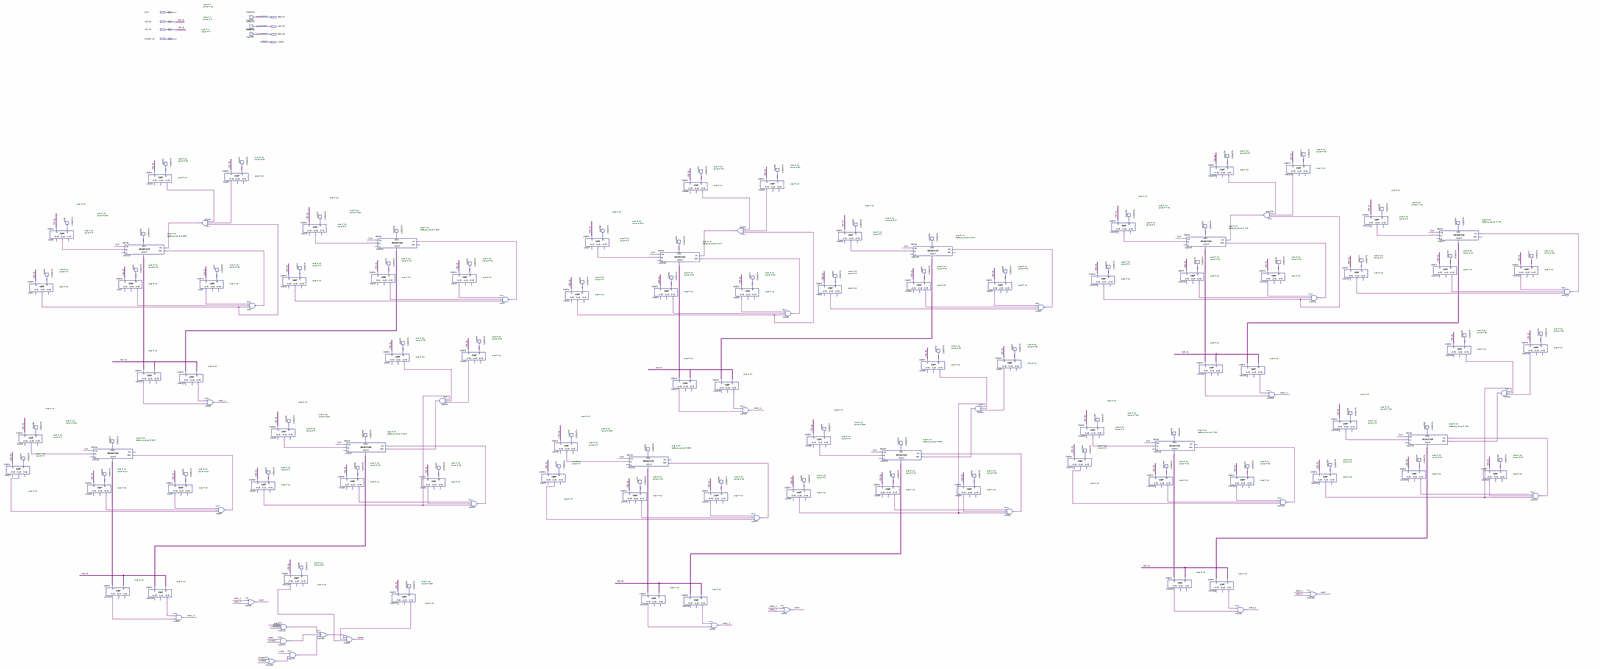
[diagram p0: schematic sheet, whole]
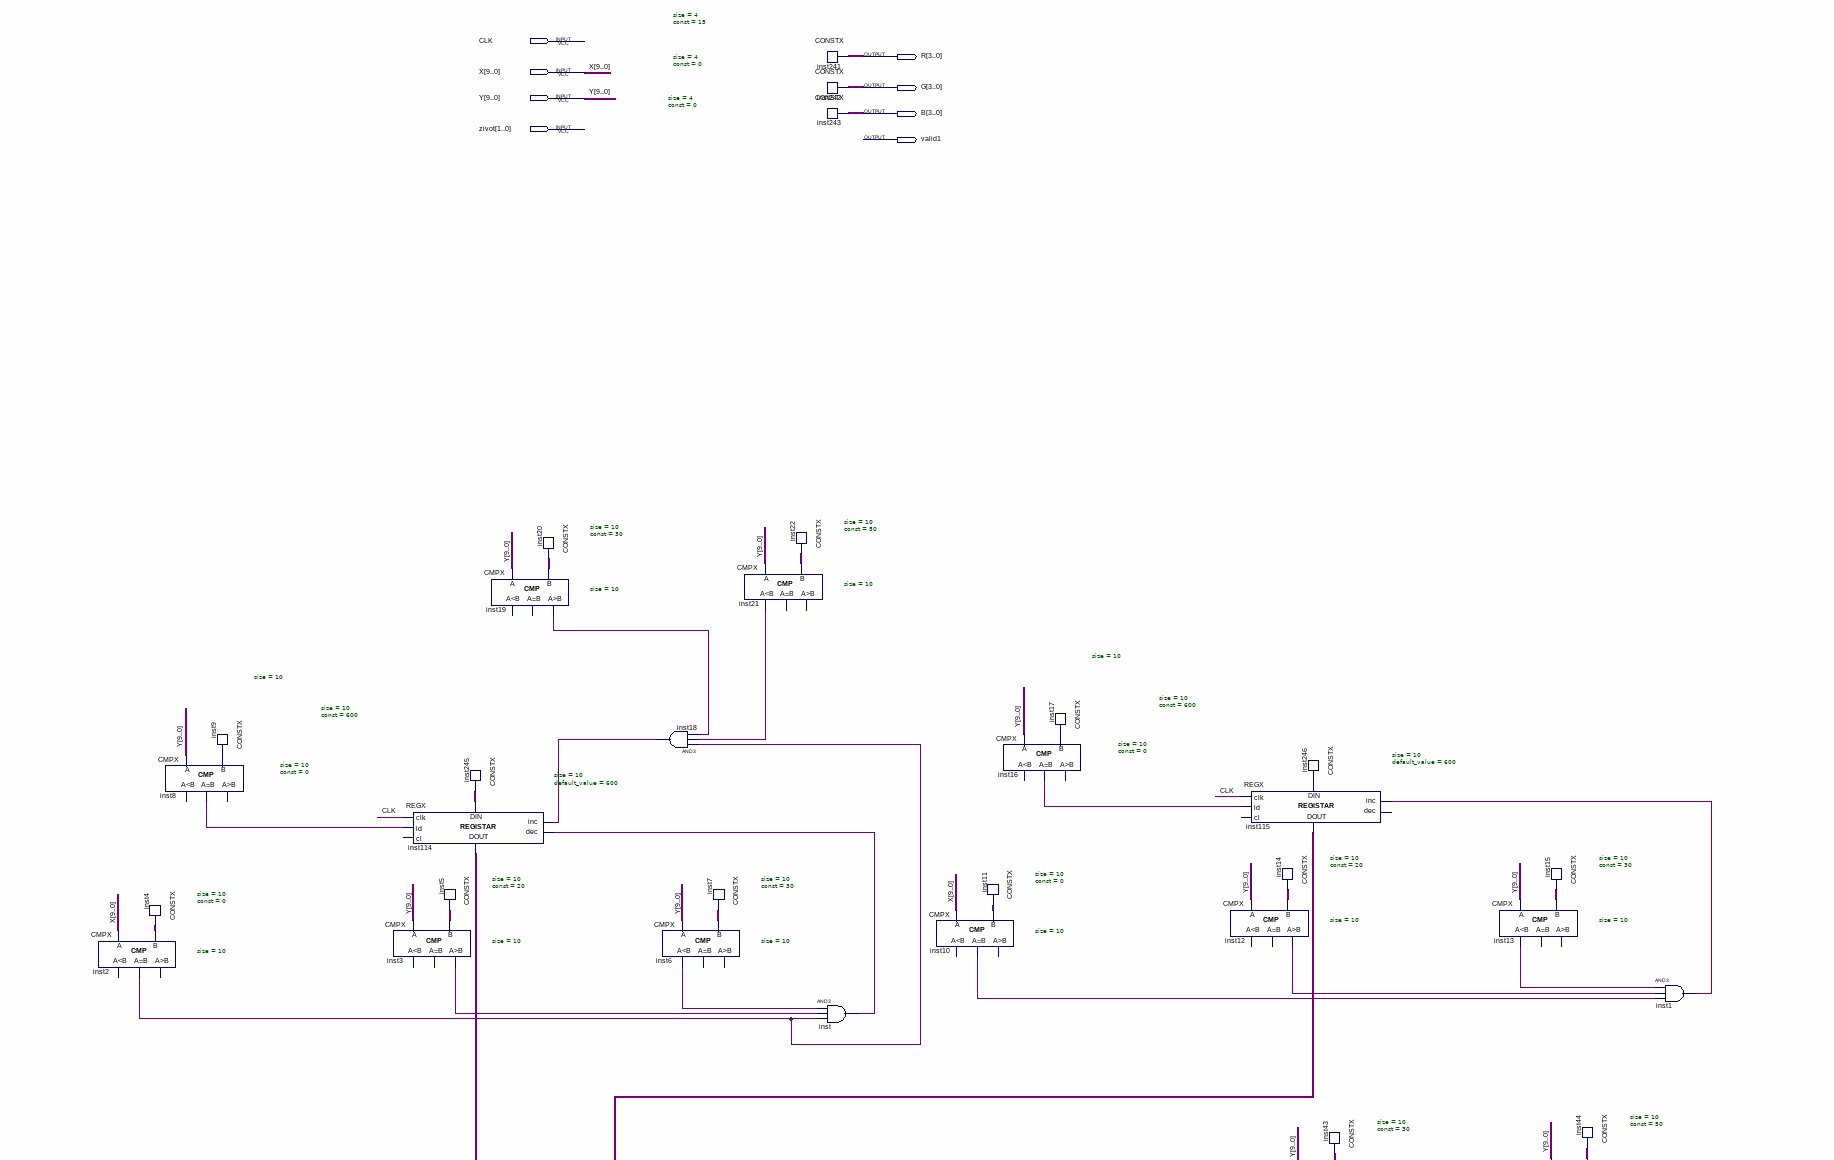
[diagram p1: schematic sheet, upper left part]
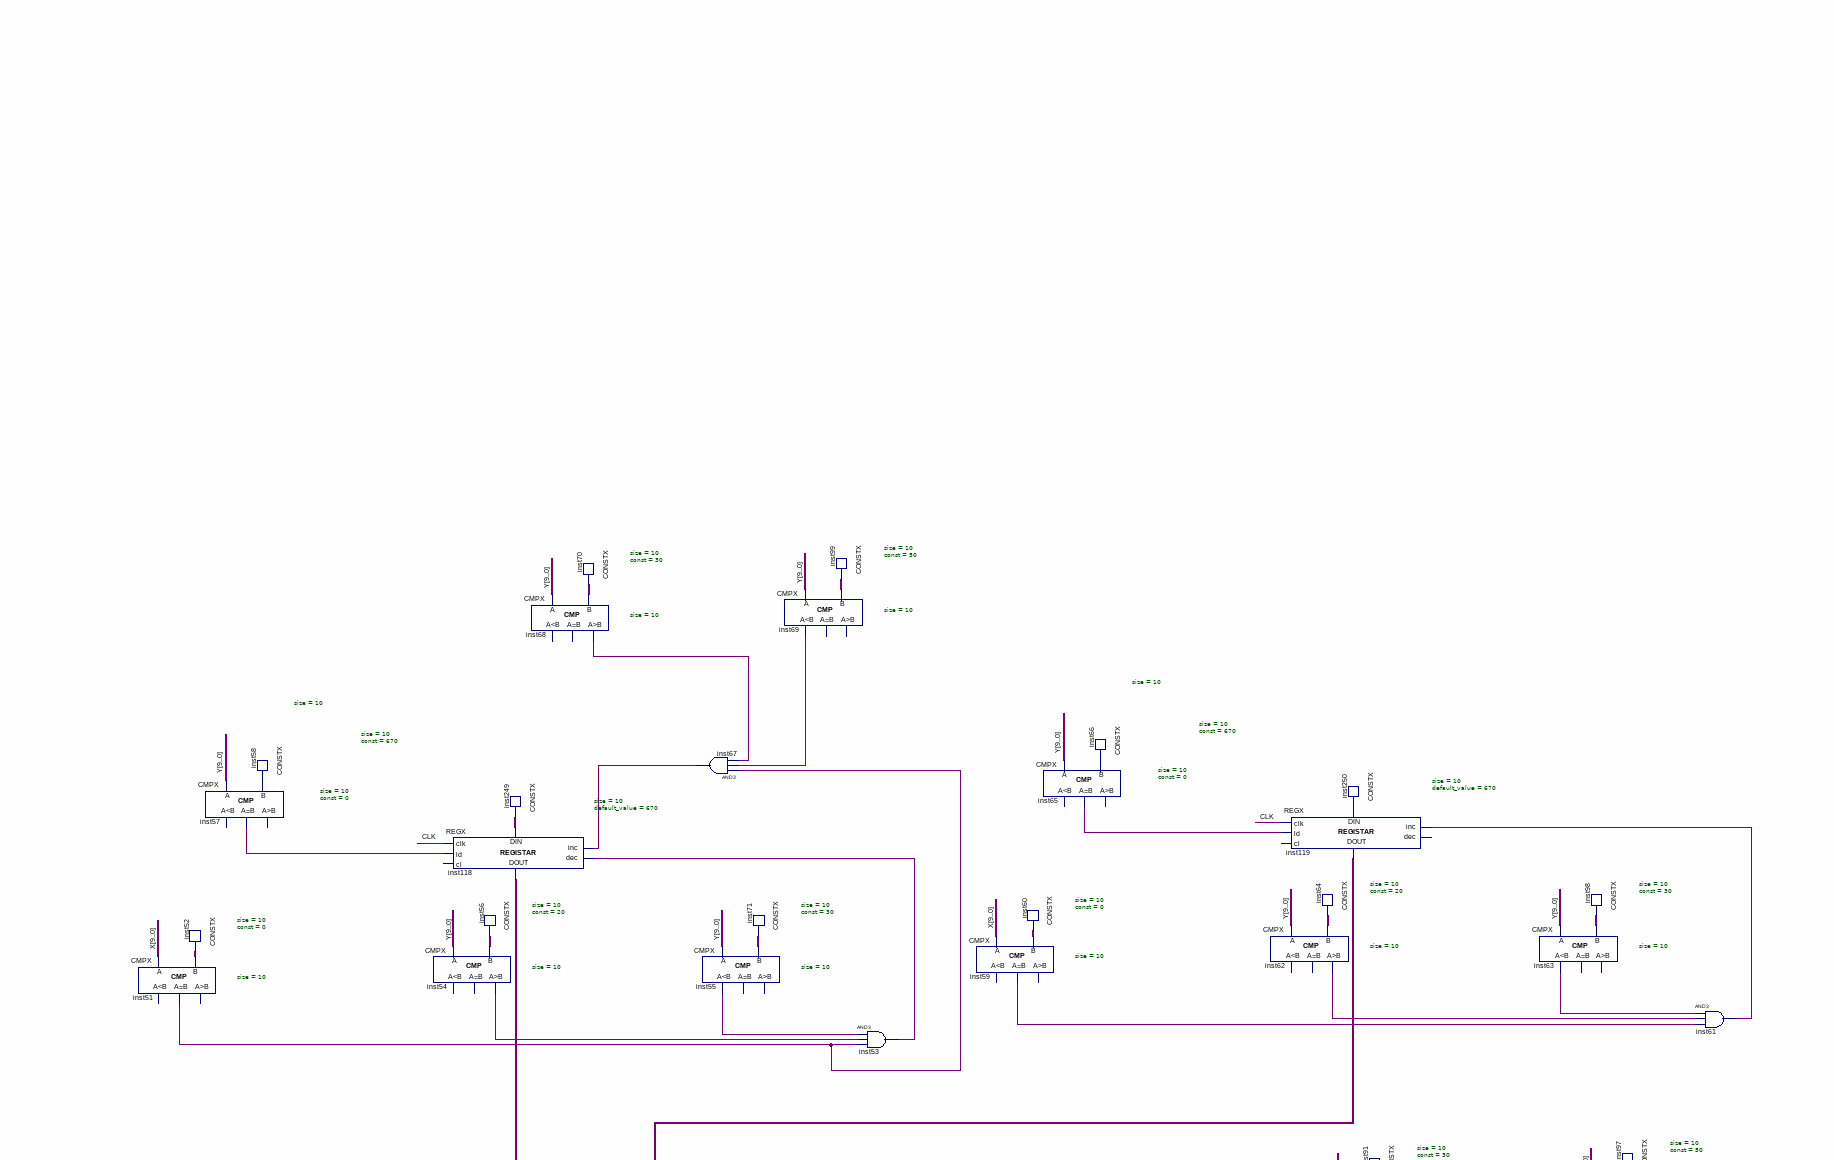
[diagram p2: schematic sheet, upper centre part]
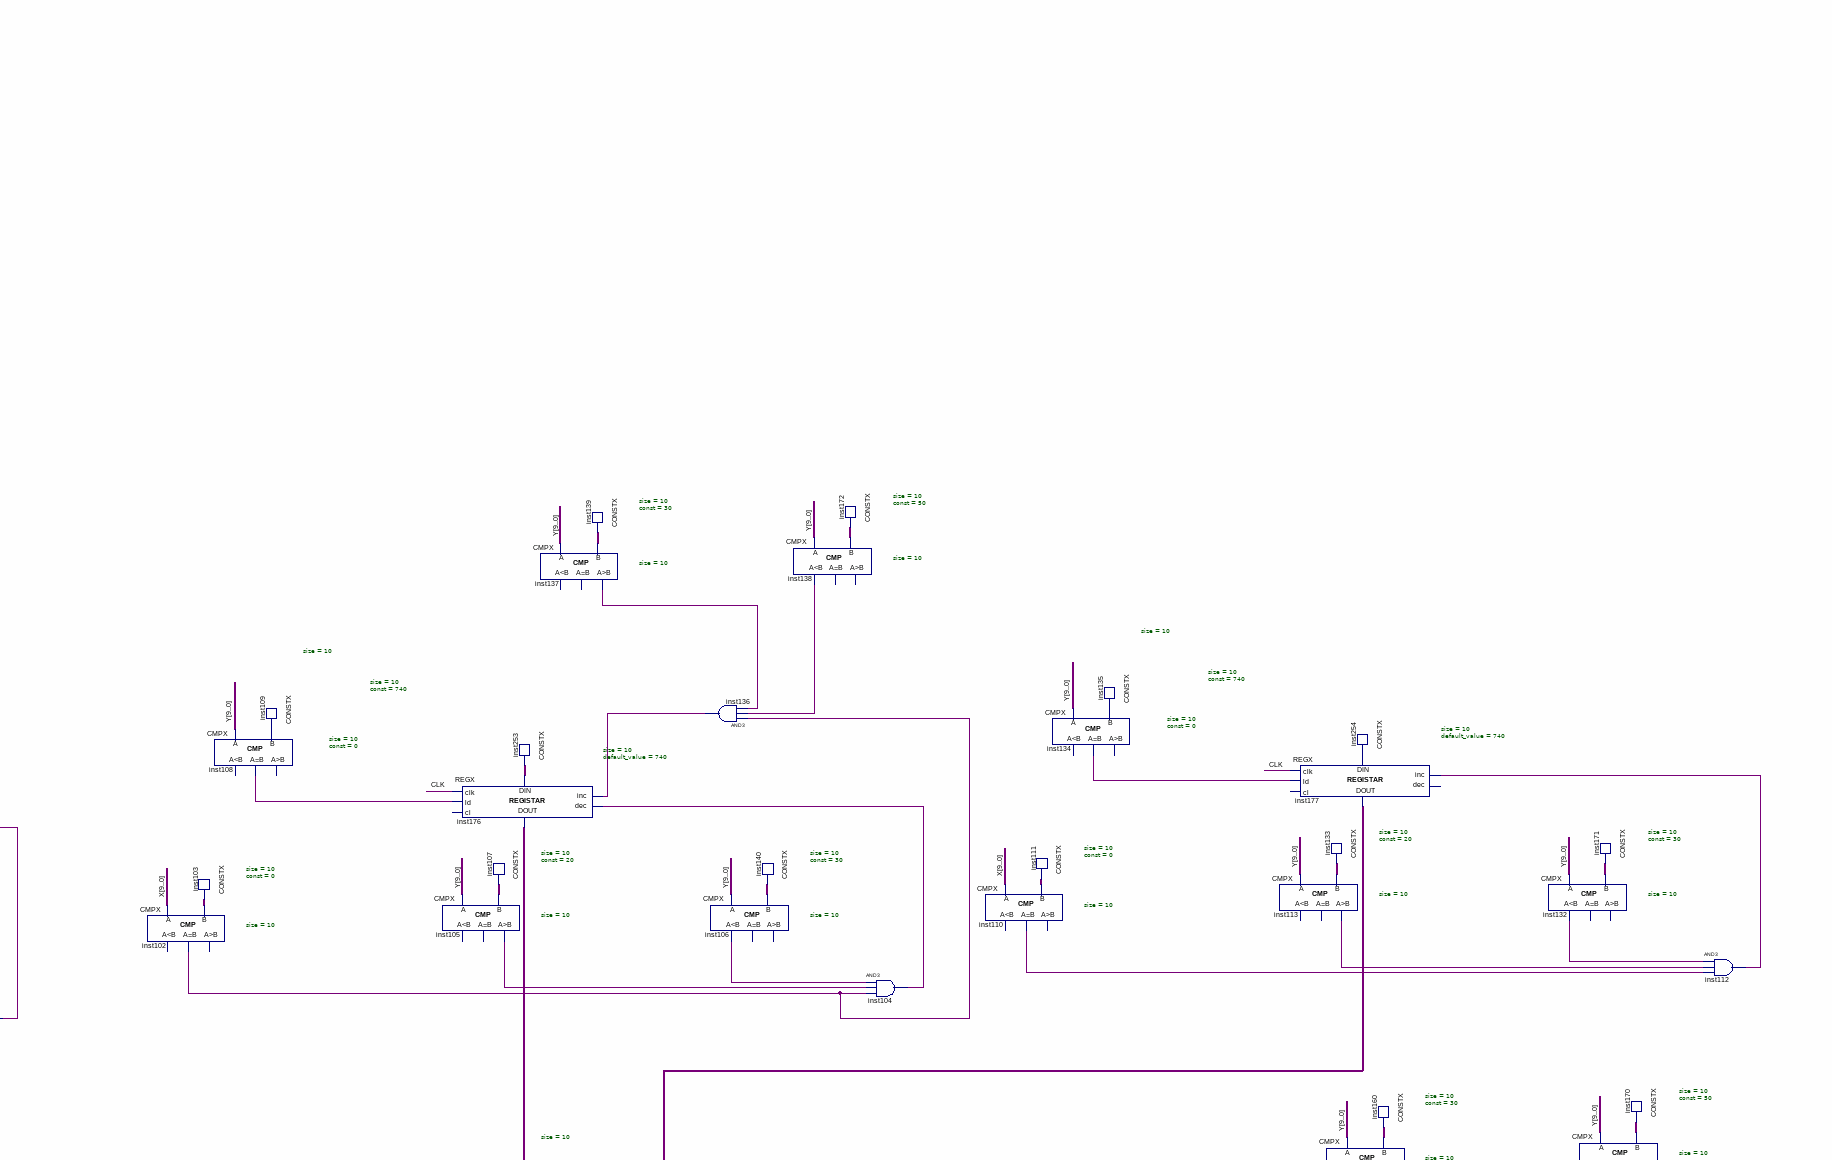
[diagram p3: schematic sheet, upper right part]
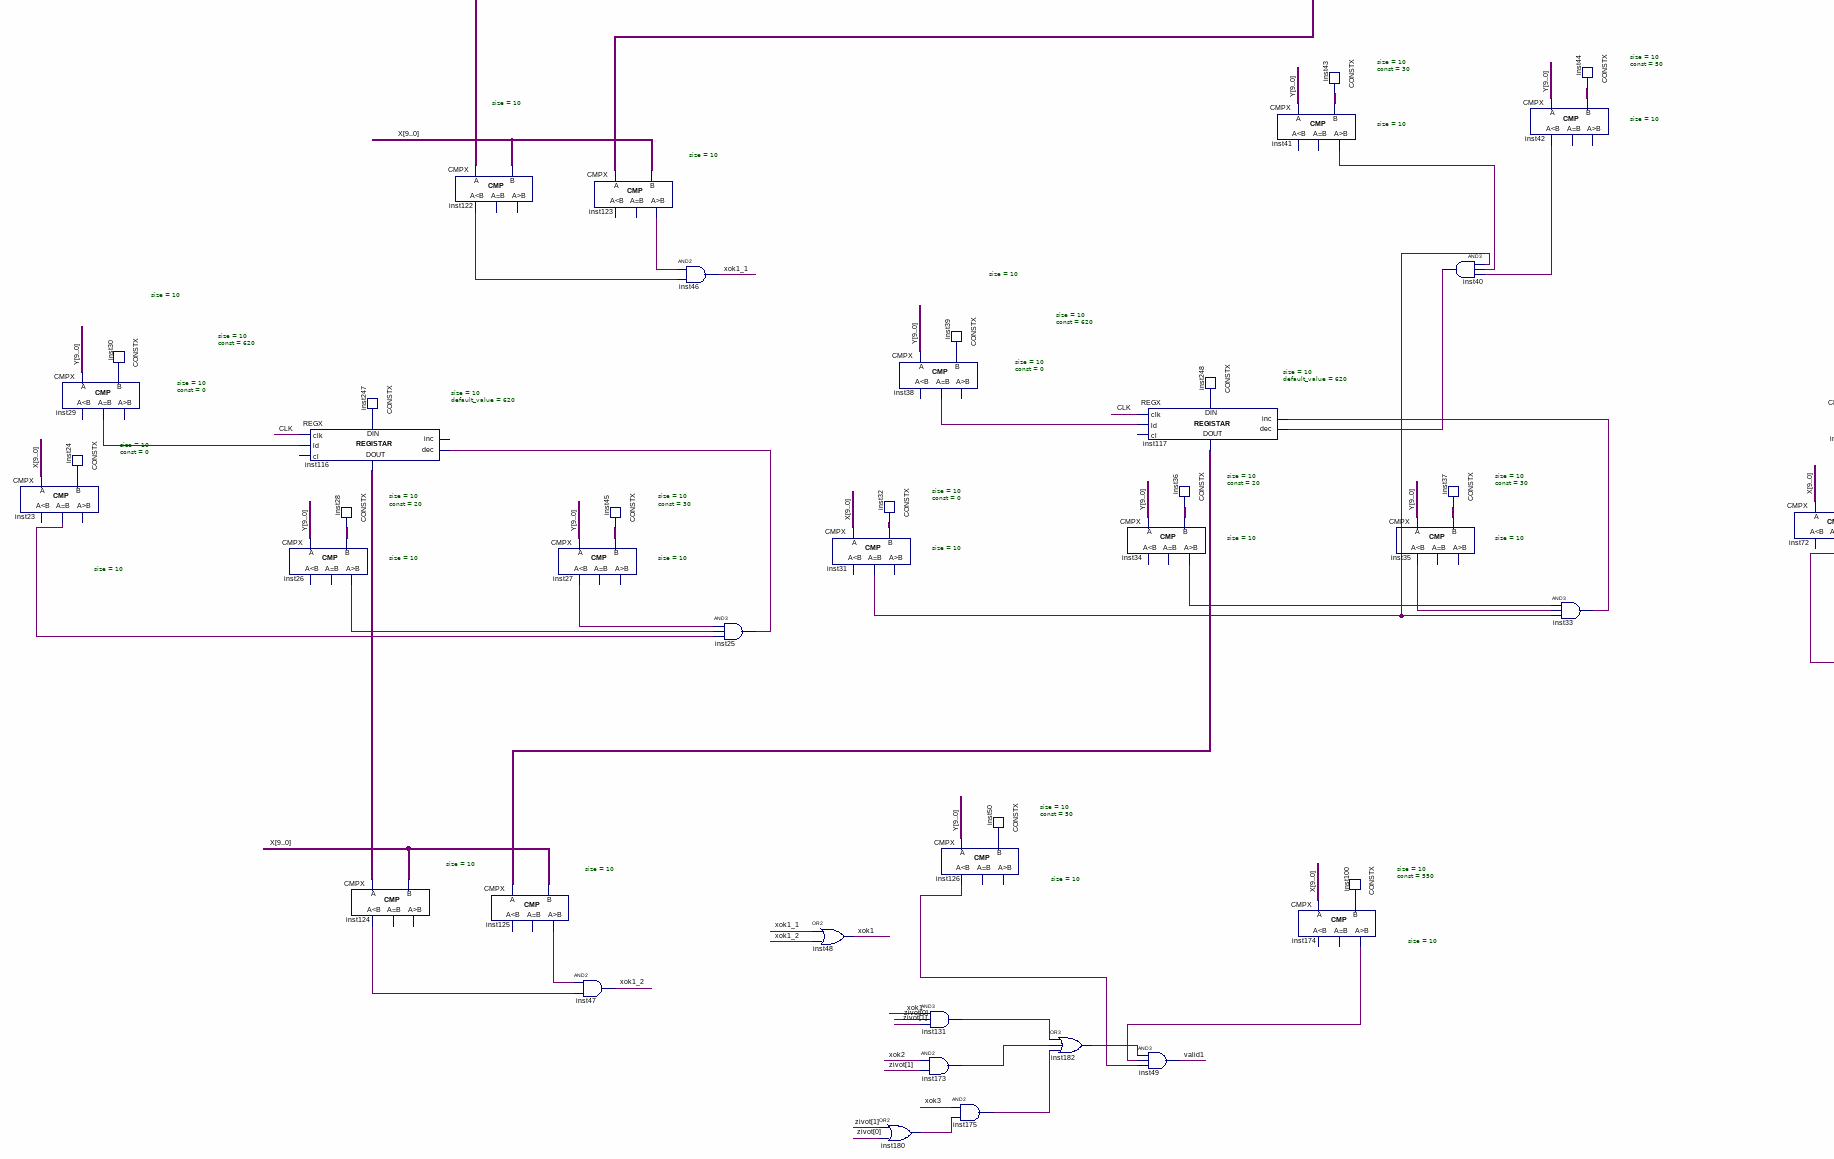
[diagram p4: schematic sheet, lower left part]
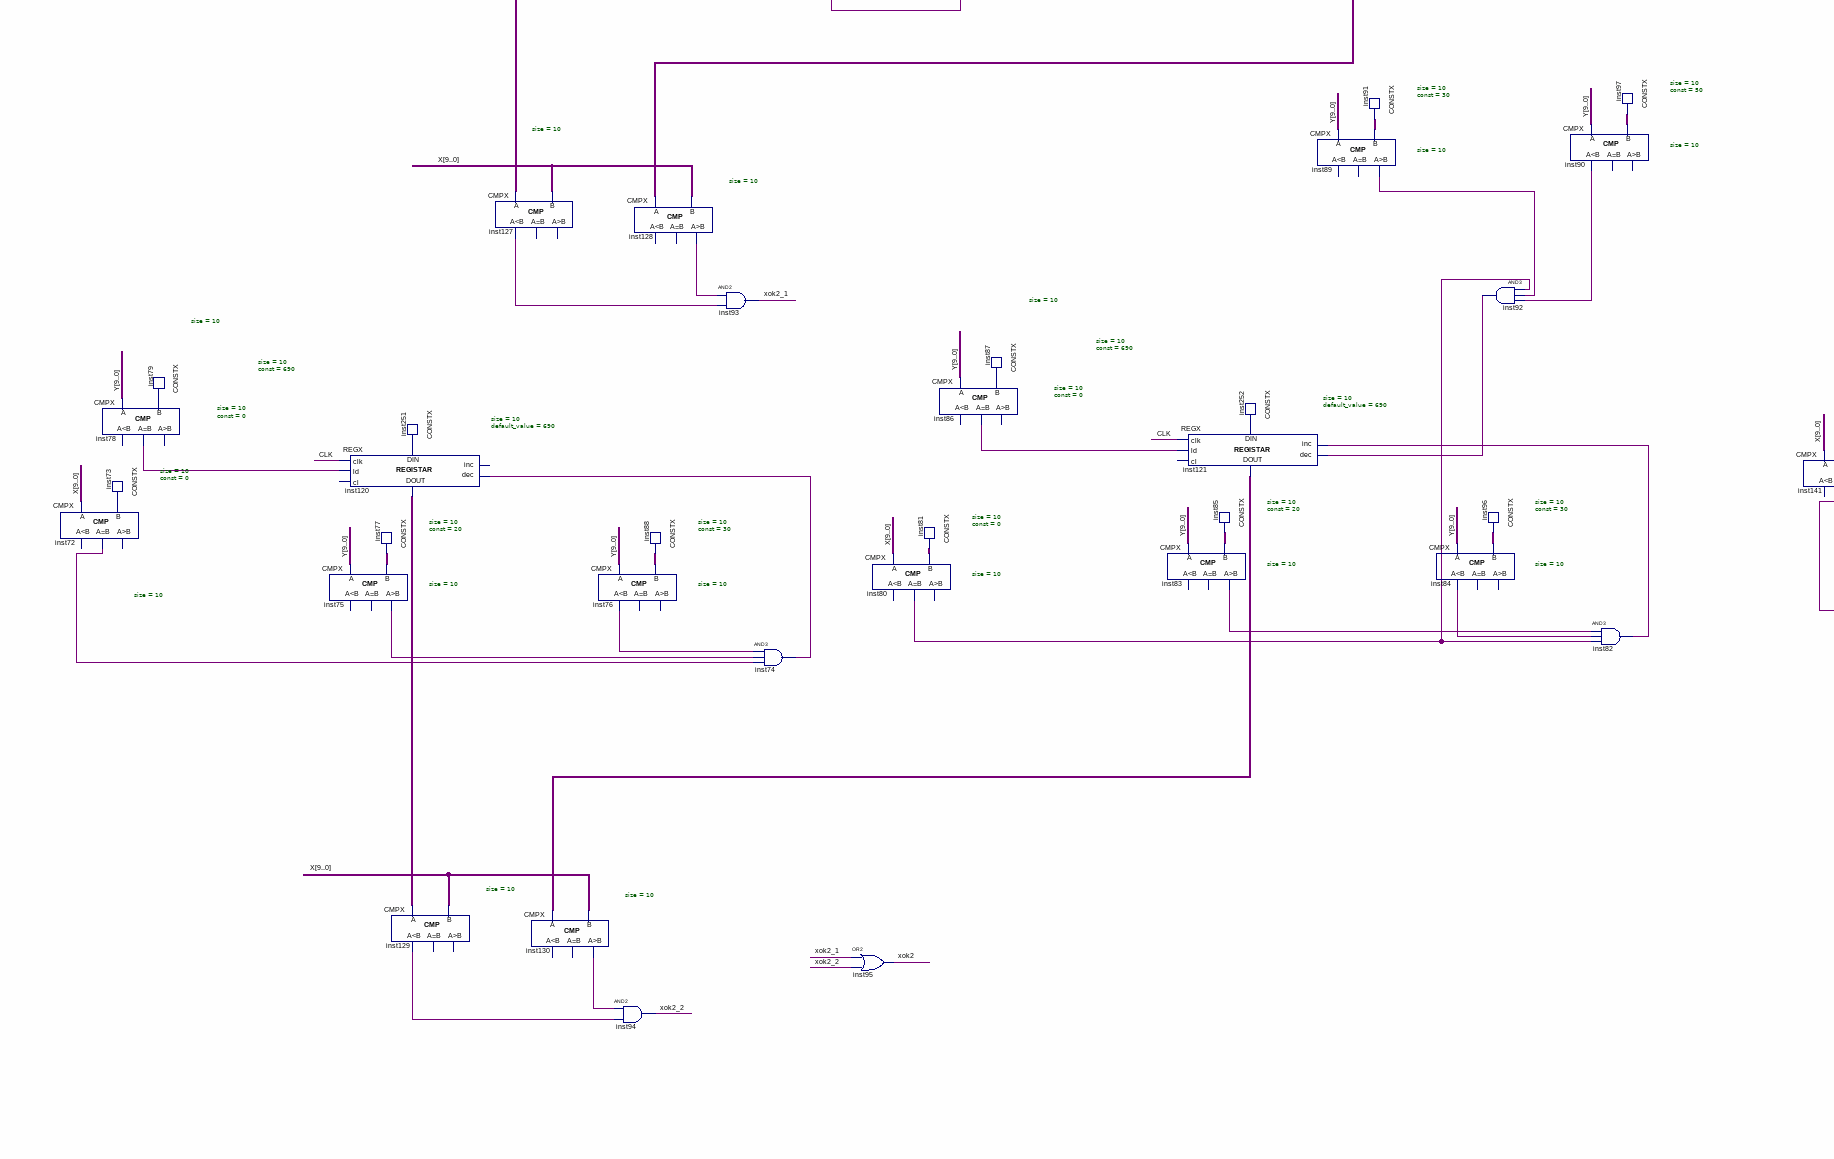
[diagram p5: schematic sheet, lower centre part]
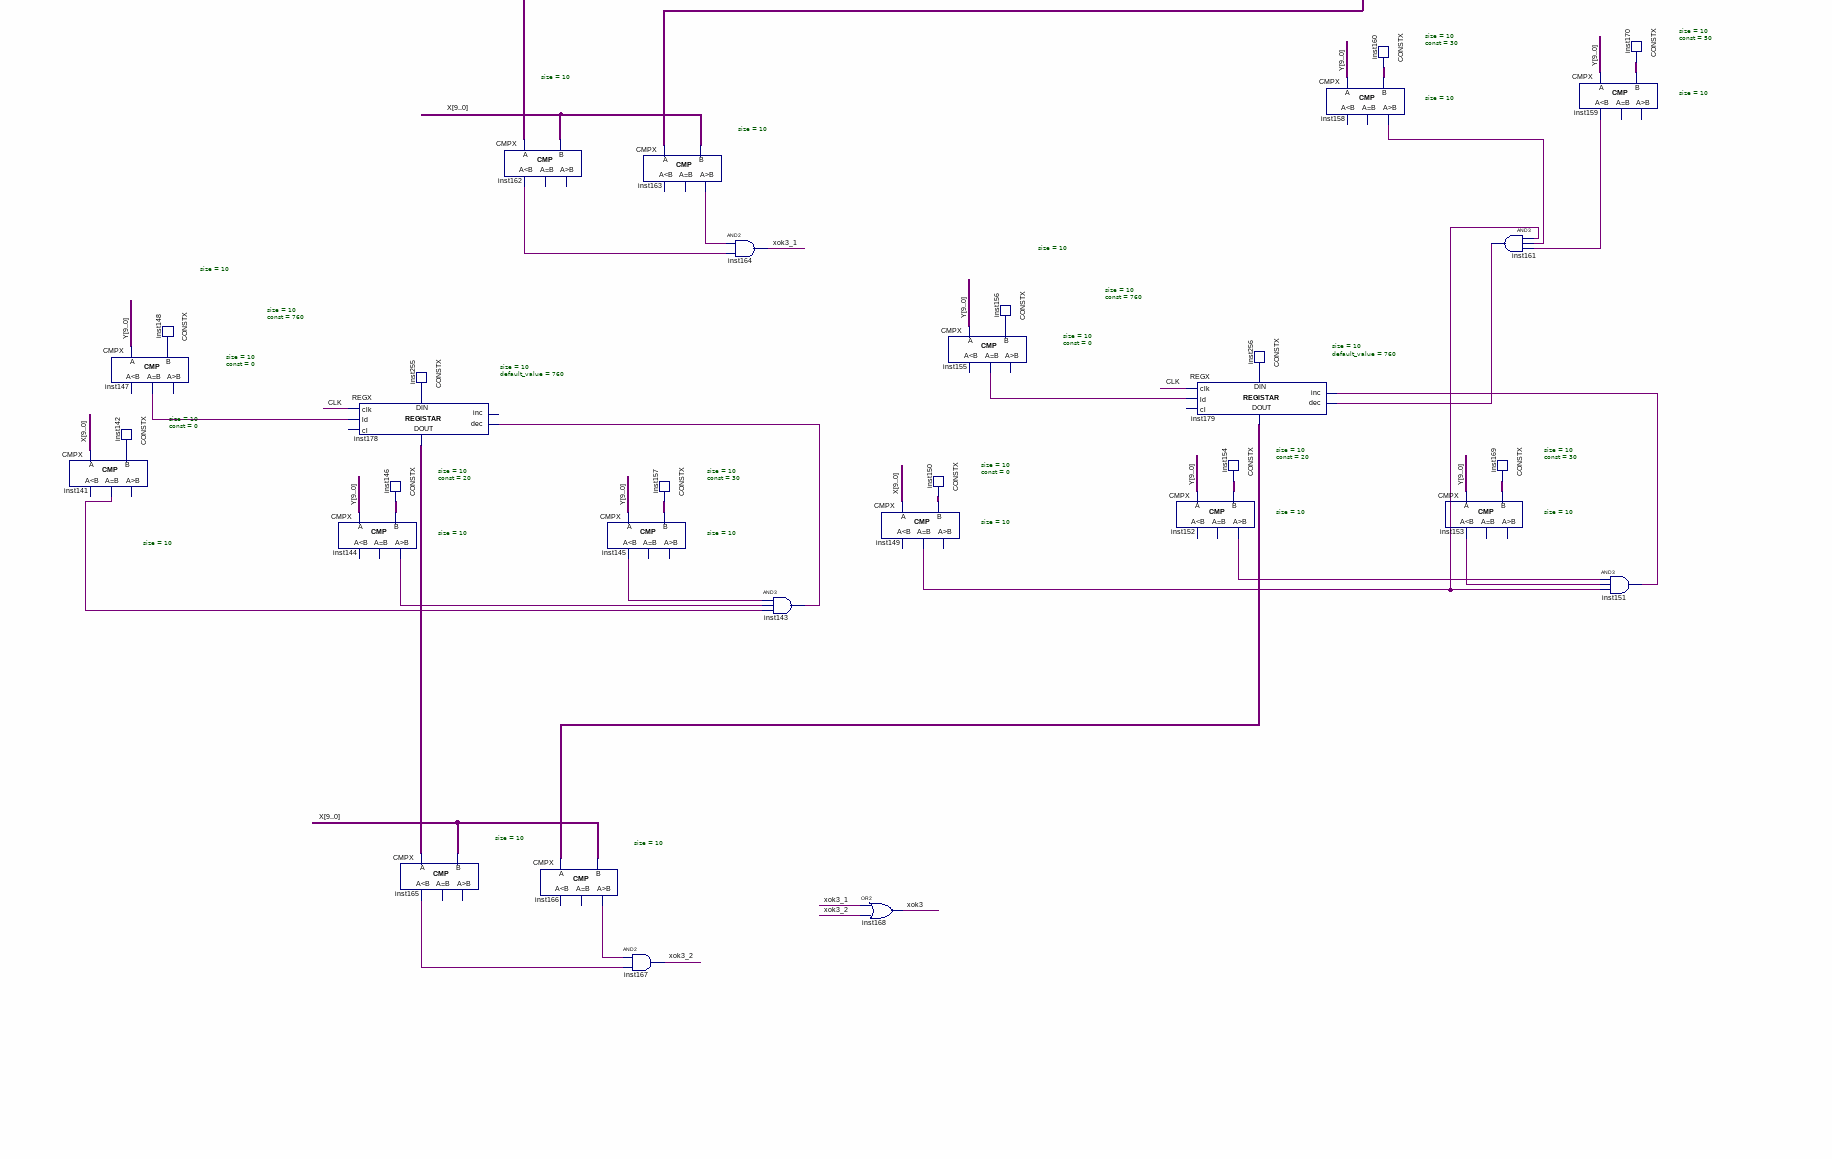
[diagram p6: schematic sheet, lower right part]
// Quartus schematic Layer3.bdf as structural Verilog: 196 symbols, 8 pins
module Layer3 (
  input  CLK,
  input  [9:0] X,
  input  [9:0] Y,
  input  [1:0] zivot,
  output [3:0] R,
  output [3:0] G,
  output [3:0] B,
  output valid1
);

  wire inst1_out, inst2_eq, inst3_gr, inst6_ls, inst8_eq, inst10_eq, inst12_gr, inst13_ls, inst16_eq,
       inst18_out, inst19_gr, inst21_ls, inst23_eq, inst25_out, inst26_gr, inst27_ls, inst29_eq, inst31_eq,
       inst33_out, inst34_gr, inst35_ls, inst38_eq, inst40_out, inst41_gr, inst42_ls, inst51_eq, inst53_out,
       inst54_gr, inst55_ls, inst57_eq, inst59_eq, inst61_out, inst62_gr, inst63_ls, inst65_eq, inst67_out,
       inst68_gr, inst69_ls, inst72_eq, inst74_out, inst75_gr, inst76_ls, inst78_eq, inst80_eq, inst82_out,
       inst83_gr, inst84_ls, inst86_eq, inst89_gr, inst90_ls, inst92_out, inst102_eq, inst104_out,
       inst105_gr, inst106_ls, inst108_eq, inst110_eq, inst112_out, inst113_gr, inst122_ls, inst123_gr,
       inst124_ls, inst125_gr, inst126_ls, inst127_ls, inst128_gr, inst129_ls, inst130_gr, inst131_out,
       inst132_ls, inst134_eq, inst136_out, inst137_gr, inst138_ls, inst141_eq, inst143_out, inst144_gr,
       inst145_ls, inst147_eq, inst149_eq, inst151_out, inst152_gr, inst153_ls, inst155_eq, inst158_gr,
       inst159_ls, inst161_out, inst162_ls, inst163_gr, inst165_ls, inst166_gr, inst173_out, inst174_gr,
       inst175_out, inst180_out, inst182_out, inst_out, xok1, xok1_1, xok1_2, xok2, xok2_1, xok2_2, xok3,
       xok3_1, xok3_2;
  wire [9:0] inst4_data, inst5_data, inst7_data, inst9_data, inst11_data, inst14_data, inst15_data,
       inst17_data, inst20_data, inst22_data, inst24_data, inst28_data, inst30_data, inst32_data,
       inst36_data, inst37_data, inst39_data, inst43_data, inst44_data, inst45_data, inst50_data,
       inst52_data, inst56_data, inst58_data, inst60_data, inst64_data, inst66_data, inst70_data,
       inst71_data, inst73_data, inst77_data, inst79_data, inst81_data, inst85_data, inst87_data,
       inst88_data, inst91_data, inst96_data, inst97_data, inst98_data, inst99_data, inst100_data,
       inst103_data, inst107_data, inst109_data, inst111_data, inst114_data_out, inst115_data_out,
       inst116_data_out, inst117_data_out, inst118_data_out, inst119_data_out, inst120_data_out,
       inst121_data_out, inst133_data, inst135_data, inst139_data, inst140_data, inst142_data, inst146_data,
       inst148_data, inst150_data, inst154_data, inst156_data, inst157_data, inst160_data, inst169_data,
       inst170_data, inst171_data, inst172_data, inst176_data_out, inst177_data_out, inst178_data_out,
       inst179_data_out, inst245_data, inst246_data, inst247_data, inst248_data, inst249_data, inst250_data,
       inst251_data, inst252_data, inst253_data, inst254_data, inst255_data, inst256_data;

  CMPX #(.size(10)) inst23 (.A(X), .B(inst24_data), .eq(inst23_eq));  // open: ls, gr
  CMPX #(.size(10)) inst29 (.A(Y), .B(inst30_data), .eq(inst29_eq));  // open: ls, gr
  CONSTX #(.size(10), .\const (0)) inst24 (.data(inst24_data));
  CMPX #(.size(10)) inst2 (.A(X), .B(inst4_data), .eq(inst2_eq));  // open: ls, gr
  CONSTX #(.size(10), .\const (0)) inst30 (.data(inst30_data));
  CONSTX #(.size(10), .\const (0)) inst4 (.data(inst4_data));
  CMPX #(.size(10)) inst8 (.A(Y), .B(inst9_data), .eq(inst8_eq));  // open: ls, gr
  CONSTX #(.size(10), .\const (0)) inst9 (.data(inst9_data));
  REGX #(.size(10), .default_value(620)) inst116 (
    .clk(CLK), .ld(inst29_eq), .dec(inst25_out), .data_in(inst247_data), .data_out(inst116_data_out));  // open: cl, inc
  CMPX #(.size(10)) inst26 (.A(Y), .B(inst28_data), .gr(inst26_gr));  // open: ls, eq
  CONSTX #(.size(10), .\const (620)) inst247 (.data(inst247_data));
  CONSTX #(.size(10), .\const (20)) inst28 (.data(inst28_data));
  CMPX #(.size(10)) inst124 (.A(inst116_data_out), .B(X), .ls(inst124_ls));  // open: eq, gr
  CMPX #(.size(10)) inst3 (.A(Y), .B(inst5_data), .gr(inst3_gr));  // open: ls, eq
  REGX #(.size(10), .default_value(600)) inst114 (
    .clk(CLK), .ld(inst8_eq), .inc(inst18_out), .dec(inst_out), .data_in(inst245_data),
    .data_out(inst114_data_out));  // open: cl
  CONSTX #(.size(10), .\const (20)) inst5 (.data(inst5_data));
  CMPX #(.size(10)) inst19 (.A(Y), .B(inst20_data), .gr(inst19_gr));  // open: ls, eq
  CONSTX #(.size(10), .\const (600)) inst245 (.data(inst245_data));
  CMPX #(.size(10)) inst122 (.A(inst114_data_out), .B(X), .ls(inst122_ls));  // open: eq, gr
  CMPX #(.size(10)) inst125 (.A(inst117_data_out), .B(X), .gr(inst125_gr));  // open: ls, eq
  CONSTX #(.size(10), .\const (30)) inst20 (.data(inst20_data));
  CMPX #(.size(10)) inst27 (.A(Y), .B(inst45_data), .ls(inst27_ls));  // open: eq, gr
  CMPX #(.size(10)) inst123 (.A(inst115_data_out), .B(X), .gr(inst123_gr));  // open: ls, eq
  CONSTX #(.size(10), .\const (30)) inst45 (.data(inst45_data));
  and inst47 (xok1_2, inst125_gr, inst124_ls);
  and inst18 (inst18_out, inst2_eq, inst21_ls, inst19_gr);
  CMPX #(.size(10)) inst6 (.A(Y), .B(inst7_data), .ls(inst6_ls));  // open: eq, gr
  and inst46 (xok1_1, inst123_gr, inst122_ls);
  CONSTX #(.size(10), .\const (30)) inst7 (.data(inst7_data));
  and inst25 (inst25_out, inst27_ls, inst26_gr, inst23_eq);
  CMPX #(.size(10)) inst21 (.A(Y), .B(inst22_data), .ls(inst21_ls));  // open: eq, gr
  CONSTX #(.size(4), .\const (15)) inst241 (.data(R));
  CONSTX #(.size(4), .\const (0)) inst242 (.data(G));
  CONSTX #(.size(4), .\const (0)) inst243 (.data(B));
  CONSTX #(.size(10), .\const (50)) inst22 (.data(inst22_data));
  or inst48 (xok1, xok1_1, xok1_2);
  and inst (inst_out, inst6_ls, inst3_gr, inst2_eq);
  CMPX #(.size(10)) inst31 (.A(X), .B(inst32_data), .eq(inst31_eq));  // open: ls, gr
  CMPX #(.size(10)) inst38 (.A(Y), .B(inst39_data), .eq(inst38_eq));  // open: ls, gr
  CONSTX #(.size(10), .\const (0)) inst32 (.data(inst32_data));
  or inst180 (inst180_out, zivot[1], zivot[0]);
  CMPX #(.size(10)) inst10 (.A(X), .B(inst11_data), .eq(inst10_eq));  // open: ls, gr
  CMPX #(.size(10)) inst126 (.A(Y), .B(inst50_data), .ls(inst126_ls));  // open: eq, gr
  and inst131 (inst131_out, xok1, zivot[0], zivot[1]);
  and inst173 (inst173_out, xok2, zivot[1]);
  CONSTX #(.size(10), .\const (0)) inst11 (.data(inst11_data));
  CONSTX #(.size(10), .\const (0)) inst39 (.data(inst39_data));
  and inst175 (inst175_out, xok3, inst180_out);
  CMPX #(.size(10)) inst16 (.A(Y), .B(inst17_data), .eq(inst16_eq));  // open: ls, gr
  CONSTX #(.size(10), .\const (50)) inst50 (.data(inst50_data));
  CONSTX #(.size(10), .\const (0)) inst17 (.data(inst17_data));
  or inst182 (inst182_out, inst131_out, inst173_out, inst175_out);
  REGX #(.size(10), .default_value(620)) inst117 (
    .clk(CLK), .ld(inst38_eq), .inc(inst33_out), .dec(inst40_out), .data_in(inst248_data),
    .data_out(inst117_data_out));  // open: cl
  CMPX #(.size(10)) inst34 (.A(Y), .B(inst36_data), .gr(inst34_gr));  // open: ls, eq
  and inst49 (valid1, inst182_out, inst174_gr, inst126_ls);
  CONSTX #(.size(10), .\const (20)) inst36 (.data(inst36_data));
  CMPX #(.size(10)) inst12 (.A(Y), .B(inst14_data), .gr(inst12_gr));  // open: ls, eq
  CONSTX #(.size(10), .\const (620)) inst248 (.data(inst248_data));
  REGX #(.size(10), .default_value(600)) inst115 (
    .clk(CLK), .ld(inst16_eq), .inc(inst1_out), .data_in(inst246_data), .data_out(inst115_data_out));  // open: cl, dec
  CMPX #(.size(10)) inst41 (.A(Y), .B(inst43_data), .gr(inst41_gr));  // open: ls, eq
  CONSTX #(.size(10), .\const (600)) inst246 (.data(inst246_data));
  CONSTX #(.size(10), .\const (20)) inst14 (.data(inst14_data));
  CMPX #(.size(10)) inst174 (.A(X), .B(inst100_data), .gr(inst174_gr));  // open: ls, eq
  CONSTX #(.size(10), .\const (30)) inst43 (.data(inst43_data));
  CONSTX #(.size(10), .\const (550)) inst100 (.data(inst100_data));
  CMPX #(.size(10)) inst35 (.A(Y), .B(inst37_data), .ls(inst35_ls));  // open: eq, gr
  and inst40 (inst40_out, inst31_eq, inst41_gr, inst42_ls);
  CONSTX #(.size(10), .\const (30)) inst37 (.data(inst37_data));
  CMPX #(.size(10)) inst13 (.A(Y), .B(inst15_data), .ls(inst13_ls));  // open: eq, gr
  CONSTX #(.size(10), .\const (30)) inst15 (.data(inst15_data));
  CMPX #(.size(10)) inst42 (.A(Y), .B(inst44_data), .ls(inst42_ls));  // open: eq, gr
  and inst33 (inst33_out, inst34_gr, inst35_ls, inst31_eq);
  CONSTX #(.size(10), .\const (50)) inst44 (.data(inst44_data));
  and inst1 (inst1_out, inst13_ls, inst12_gr, inst10_eq);
  CMPX #(.size(10)) inst72 (.A(X), .B(inst73_data), .eq(inst72_eq));  // open: ls, gr
  CMPX #(.size(10)) inst78 (.A(Y), .B(inst79_data), .eq(inst78_eq));  // open: ls, gr
  CONSTX #(.size(10), .\const (0)) inst73 (.data(inst73_data));
  CMPX #(.size(10)) inst51 (.A(X), .B(inst52_data), .eq(inst51_eq));  // open: ls, gr
  CONSTX #(.size(10), .\const (0)) inst79 (.data(inst79_data));
  CMPX #(.size(10)) inst57 (.A(Y), .B(inst58_data), .eq(inst57_eq));  // open: ls, gr
  CONSTX #(.size(10), .\const (0)) inst52 (.data(inst52_data));
  CONSTX #(.size(10), .\const (0)) inst58 (.data(inst58_data));
  CMPX #(.size(10)) inst75 (.A(Y), .B(inst77_data), .gr(inst75_gr));  // open: ls, eq
  REGX #(.size(10), .default_value(690)) inst120 (
    .clk(CLK), .ld(inst78_eq), .dec(inst74_out), .data_in(inst251_data), .data_out(inst120_data_out));  // open: cl, inc
  CONSTX #(.size(10), .\const (690)) inst251 (.data(inst251_data));
  CONSTX #(.size(10), .\const (20)) inst77 (.data(inst77_data));
  CMPX #(.size(10)) inst129 (.A(inst120_data_out), .B(X), .ls(inst129_ls));  // open: eq, gr
  REGX #(.size(10), .default_value(670)) inst118 (
    .clk(CLK), .ld(inst57_eq), .inc(inst67_out), .dec(inst53_out), .data_in(inst249_data),
    .data_out(inst118_data_out));  // open: cl
  CMPX #(.size(10)) inst54 (.A(Y), .B(inst56_data), .gr(inst54_gr));  // open: ls, eq
  CONSTX #(.size(10), .\const (20)) inst56 (.data(inst56_data));
  CMPX #(.size(10)) inst127 (.A(inst118_data_out), .B(X), .ls(inst127_ls));  // open: eq, gr
  CMPX #(.size(10)) inst68 (.A(Y), .B(inst70_data), .gr(inst68_gr));  // open: ls, eq
  CONSTX #(.size(10), .\const (670)) inst249 (.data(inst249_data));
  CMPX #(.size(10)) inst130 (.A(inst121_data_out), .B(X), .gr(inst130_gr));  // open: ls, eq
  CONSTX #(.size(10), .\const (30)) inst70 (.data(inst70_data));
  CMPX #(.size(10)) inst76 (.A(Y), .B(inst88_data), .ls(inst76_ls));  // open: eq, gr
  CMPX #(.size(10)) inst128 (.A(inst119_data_out), .B(X), .gr(inst128_gr));  // open: ls, eq
  CONSTX #(.size(10), .\const (30)) inst88 (.data(inst88_data));
  and inst94 (xok2_2, inst130_gr, inst129_ls);
  CMPX #(.size(10)) inst55 (.A(Y), .B(inst71_data), .ls(inst55_ls));  // open: eq, gr
  and inst67 (inst67_out, inst51_eq, inst69_ls, inst68_gr);
  and inst93 (xok2_1, inst128_gr, inst127_ls);
  CMPX #(.size(10)) inst69 (.A(Y), .B(inst99_data), .ls(inst69_ls));  // open: eq, gr
  CONSTX #(.size(10), .\const (30)) inst71 (.data(inst71_data));
  and inst74 (inst74_out, inst76_ls, inst75_gr, inst72_eq);
  CONSTX #(.size(10), .\const (50)) inst99 (.data(inst99_data));
  and inst53 (inst53_out, inst55_ls, inst54_gr, inst51_eq);
  or inst95 (xok2, xok2_1, xok2_2);
  CMPX #(.size(10)) inst80 (.A(X), .B(inst81_data), .eq(inst80_eq));  // open: ls, gr
  CMPX #(.size(10)) inst86 (.A(Y), .B(inst87_data), .eq(inst86_eq));  // open: ls, gr
  CONSTX #(.size(10), .\const (0)) inst81 (.data(inst81_data));
  CMPX #(.size(10)) inst59 (.A(X), .B(inst60_data), .eq(inst59_eq));  // open: ls, gr
  CONSTX #(.size(10), .\const (0)) inst87 (.data(inst87_data));
  CONSTX #(.size(10), .\const (0)) inst60 (.data(inst60_data));
  CMPX #(.size(10)) inst65 (.A(Y), .B(inst66_data), .eq(inst65_eq));  // open: ls, gr
  CONSTX #(.size(10), .\const (0)) inst66 (.data(inst66_data));
  REGX #(.size(10), .default_value(690)) inst121 (
    .clk(CLK), .ld(inst86_eq), .inc(inst82_out), .dec(inst92_out), .data_in(inst252_data),
    .data_out(inst121_data_out));  // open: cl
  CMPX #(.size(10)) inst83 (.A(Y), .B(inst85_data), .gr(inst83_gr));  // open: ls, eq
  CONSTX #(.size(10), .\const (20)) inst85 (.data(inst85_data));
  CMPX #(.size(10)) inst62 (.A(Y), .B(inst64_data), .gr(inst62_gr));  // open: ls, eq
  CONSTX #(.size(10), .\const (690)) inst252 (.data(inst252_data));
  REGX #(.size(10), .default_value(670)) inst119 (
    .clk(CLK), .ld(inst65_eq), .inc(inst61_out), .data_in(inst250_data), .data_out(inst119_data_out));  // open: cl, dec
  CONSTX #(.size(10), .\const (20)) inst64 (.data(inst64_data));
  CMPX #(.size(10)) inst89 (.A(Y), .B(inst91_data), .gr(inst89_gr));  // open: ls, eq
  CONSTX #(.size(10), .\const (670)) inst250 (.data(inst250_data));
  CONSTX #(.size(10), .\const (30)) inst91 (.data(inst91_data));
  CMPX #(.size(10)) inst84 (.A(Y), .B(inst96_data), .ls(inst84_ls));  // open: eq, gr
  CONSTX #(.size(10), .\const (30)) inst96 (.data(inst96_data));
  and inst92 (inst92_out, inst80_eq, inst89_gr, inst90_ls);
  CMPX #(.size(10)) inst63 (.A(Y), .B(inst98_data), .ls(inst63_ls));  // open: eq, gr
  CMPX #(.size(10)) inst90 (.A(Y), .B(inst97_data), .ls(inst90_ls));  // open: eq, gr
  CONSTX #(.size(10), .\const (30)) inst98 (.data(inst98_data));
  and inst82 (inst82_out, inst83_gr, inst84_ls, inst80_eq);
  CONSTX #(.size(10), .\const (50)) inst97 (.data(inst97_data));
  and inst61 (inst61_out, inst63_ls, inst62_gr, inst59_eq);
  CMPX #(.size(10)) inst141 (.A(X), .B(inst142_data), .eq(inst141_eq));  // open: ls, gr
  CMPX #(.size(10)) inst147 (.A(Y), .B(inst148_data), .eq(inst147_eq));  // open: ls, gr
  CONSTX #(.size(10), .\const (0)) inst142 (.data(inst142_data));
  CMPX #(.size(10)) inst102 (.A(X), .B(inst103_data), .eq(inst102_eq));  // open: ls, gr
  CONSTX #(.size(10), .\const (0)) inst148 (.data(inst148_data));
  CONSTX #(.size(10), .\const (0)) inst103 (.data(inst103_data));
  CMPX #(.size(10)) inst108 (.A(Y), .B(inst109_data), .eq(inst108_eq));  // open: ls, gr
  CONSTX #(.size(10), .\const (0)) inst109 (.data(inst109_data));
  REGX #(.size(10), .default_value(760)) inst178 (
    .clk(CLK), .ld(inst147_eq), .dec(inst143_out), .data_in(inst255_data), .data_out(inst178_data_out));  // open: cl, inc
  CMPX #(.size(10)) inst144 (.A(Y), .B(inst146_data), .gr(inst144_gr));  // open: ls, eq
  CONSTX #(.size(10), .\const (760)) inst255 (.data(inst255_data));
  CONSTX #(.size(10), .\const (20)) inst146 (.data(inst146_data));
  CMPX #(.size(10)) inst165 (.A(inst178_data_out), .B(X), .ls(inst165_ls));  // open: eq, gr
  CMPX #(.size(10)) inst105 (.A(Y), .B(inst107_data), .gr(inst105_gr));  // open: ls, eq
  REGX #(.size(10), .default_value(740)) inst176 (
    .clk(CLK), .ld(inst108_eq), .inc(inst136_out), .dec(inst104_out), .data_in(inst253_data),
    .data_out(inst176_data_out));  // open: cl
  CONSTX #(.size(10), .\const (20)) inst107 (.data(inst107_data));
  CMPX #(.size(10)) inst137 (.A(Y), .B(inst139_data), .gr(inst137_gr));  // open: ls, eq
  CONSTX #(.size(10), .\const (740)) inst253 (.data(inst253_data));
  CMPX #(.size(10)) inst162 (.A(inst176_data_out), .B(X), .ls(inst162_ls));  // open: eq, gr
  CMPX #(.size(10)) inst166 (.A(inst179_data_out), .B(X), .gr(inst166_gr));  // open: ls, eq
  CONSTX #(.size(10), .\const (30)) inst139 (.data(inst139_data));
  CMPX #(.size(10)) inst145 (.A(Y), .B(inst157_data), .ls(inst145_ls));  // open: eq, gr
  CMPX #(.size(10)) inst163 (.A(inst177_data_out), .B(X), .gr(inst163_gr));  // open: ls, eq
  CONSTX #(.size(10), .\const (30)) inst157 (.data(inst157_data));
  and inst167 (xok3_2, inst166_gr, inst165_ls);
  and inst136 (inst136_out, inst102_eq, inst138_ls, inst137_gr);
  CMPX #(.size(10)) inst106 (.A(Y), .B(inst140_data), .ls(inst106_ls));  // open: eq, gr
  and inst164 (xok3_1, inst163_gr, inst162_ls);
  CONSTX #(.size(10), .\const (30)) inst140 (.data(inst140_data));
  and inst143 (inst143_out, inst145_ls, inst144_gr, inst141_eq);
  CMPX #(.size(10)) inst138 (.A(Y), .B(inst172_data), .ls(inst138_ls));  // open: eq, gr
  CONSTX #(.size(10), .\const (50)) inst172 (.data(inst172_data));
  or inst168 (xok3, xok3_1, xok3_2);
  and inst104 (inst104_out, inst106_ls, inst105_gr, inst102_eq);
  CMPX #(.size(10)) inst149 (.A(X), .B(inst150_data), .eq(inst149_eq));  // open: ls, gr
  CMPX #(.size(10)) inst155 (.A(Y), .B(inst156_data), .eq(inst155_eq));  // open: ls, gr
  CONSTX #(.size(10), .\const (0)) inst150 (.data(inst150_data));
  CMPX #(.size(10)) inst110 (.A(X), .B(inst111_data), .eq(inst110_eq));  // open: ls, gr
  CONSTX #(.size(10), .\const (0)) inst111 (.data(inst111_data));
  CONSTX #(.size(10), .\const (0)) inst156 (.data(inst156_data));
  CMPX #(.size(10)) inst134 (.A(Y), .B(inst135_data), .eq(inst134_eq));  // open: ls, gr
  CONSTX #(.size(10), .\const (0)) inst135 (.data(inst135_data));
  REGX #(.size(10), .default_value(760)) inst179 (
    .clk(CLK), .ld(inst155_eq), .inc(inst151_out), .dec(inst161_out), .data_in(inst256_data),
    .data_out(inst179_data_out));  // open: cl
  CMPX #(.size(10)) inst152 (.A(Y), .B(inst154_data), .gr(inst152_gr));  // open: ls, eq
  CONSTX #(.size(10), .\const (20)) inst154 (.data(inst154_data));
  CMPX #(.size(10)) inst113 (.A(Y), .B(inst133_data), .gr(inst113_gr));  // open: ls, eq
  CONSTX #(.size(10), .\const (760)) inst256 (.data(inst256_data));
  REGX #(.size(10), .default_value(740)) inst177 (
    .clk(CLK), .ld(inst134_eq), .inc(inst112_out), .data_in(inst254_data), .data_out(inst177_data_out));  // open: cl, dec
  CMPX #(.size(10)) inst158 (.A(Y), .B(inst160_data), .gr(inst158_gr));  // open: ls, eq
  CONSTX #(.size(10), .\const (740)) inst254 (.data(inst254_data));
  CONSTX #(.size(10), .\const (20)) inst133 (.data(inst133_data));
  CONSTX #(.size(10), .\const (30)) inst160 (.data(inst160_data));
  CMPX #(.size(10)) inst153 (.A(Y), .B(inst169_data), .ls(inst153_ls));  // open: eq, gr
  and inst161 (inst161_out, inst149_eq, inst158_gr, inst159_ls);
  CONSTX #(.size(10), .\const (30)) inst169 (.data(inst169_data));
  CMPX #(.size(10)) inst132 (.A(Y), .B(inst171_data), .ls(inst132_ls));  // open: eq, gr
  CONSTX #(.size(10), .\const (30)) inst171 (.data(inst171_data));
  CMPX #(.size(10)) inst159 (.A(Y), .B(inst170_data), .ls(inst159_ls));  // open: eq, gr
  and inst151 (inst151_out, inst152_gr, inst153_ls, inst149_eq);
  CONSTX #(.size(10), .\const (50)) inst170 (.data(inst170_data));
  and inst112 (inst112_out, inst132_ls, inst113_gr, inst110_eq);
endmodule
